# EAGLE design akabeacon_square (EAGLE 7.2.0)
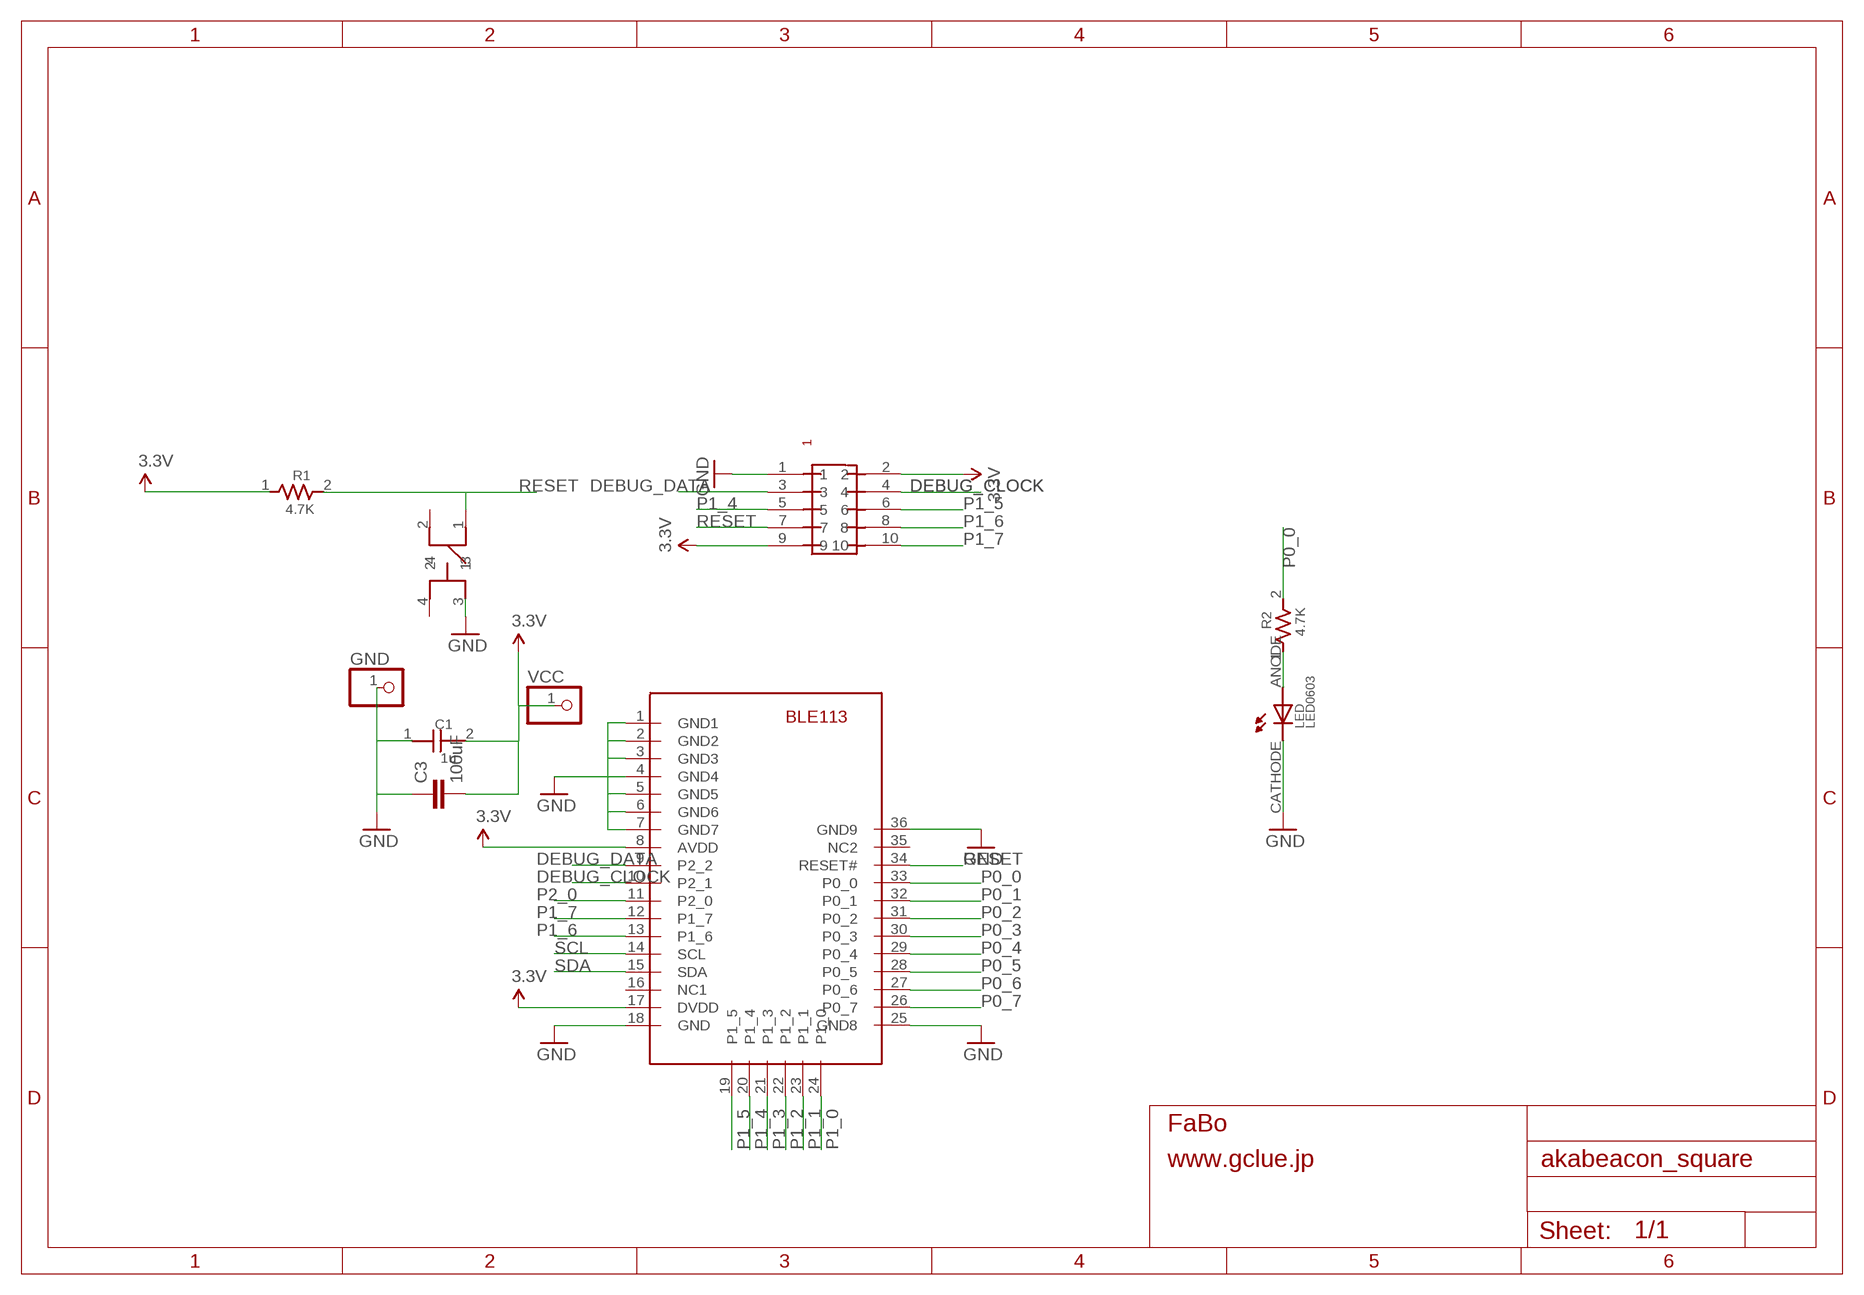
[diagram p0: schematic, sheet 1]

## Parts
C1  1u  CAPACITOR0603  [0603]
C3  100uF  10UF-6.3V-20%(1206)  [1206]
GND  PINHD-1X1CB  [1X01-CLEANBIG]
LED  LED0603  [0603]
R1  4.7K  RESISTOR0603  [0603]
R2  4.7K  RESISTOR0603  [0603]
U$2  PIN-HEADER-SMT(1.27MM)2X5  [PIN-HEADER-SMT(1.27MM)2X5]
U$5  BLE113  [BLE113]
U$8  SWITCH-LS6J2M-T  [SWICTH-LS6J2M-T]
VCC  PINHD-1X1CB  [1X01-CLEANBIG]

## Nets
3.3V: C1.2 C3.2 R1.1 U$2.2 U$2.9 U$5.8(AVDD) U$5.17(DVDD) VCC.1
DEBUG_CLOCK: U$2.4 U$5.10(P2_1)
DEBUG_DATA: U$2.3 U$5.9(P2_2)
GND: C1.1 C3.1 GND.1 LED.CATHODE U$2.1 U$5.1(GND1) U$5.2(GND2) U$5.3(GND3) U$5.4(GND4) U$5.5(GND5) U$5.6(GND6) U$5.7(GND7) U$5.18(GND) U$5.25(GND8) U$5.36(GND9) U$8.3
N$2: LED.ANODE R2.1
P0_0: R2.2 U$5.33(P0_0)
P0_1: U$5.32(P0_1)
P0_2: U$5.31(P0_2)
P0_3: U$5.30(P0_3)
P0_4: U$5.29(P0_4)
P0_5: U$5.28(P0_5)
P0_6: U$5.27(P0_6)
P0_7: U$5.26(P0_7)
P1_0: U$5.24(P1_0)
P1_1: U$5.23(P1_1)
P1_2: U$5.22(P1_2)
P1_3: U$5.21(P1_3)
P1_4: U$2.5 U$5.20(P1_4)
P1_5: U$2.6 U$5.19(P1_5)
P1_6: U$2.8 U$5.13(P1_6)
P1_7: U$2.10 U$5.12(P1_7)
P2_0: U$5.11(P2_0)
RESET: R1.2 U$2.7 U$5.34(RESET#) U$8.1
SCL: U$5.14(SCL)
SDA: U$5.15(SDA)
Unconnected: U$5.16(NC1) U$5.35(NC2) U$8.2 U$8.4

## Library data of the parts
C1 = GClue-Capacitor:CAPACITOR
C3 = SparkFun-Capacitors:10UF-6.3V-20%(1206): CAP-10057 Ceramic; PROD_ID: CAP-10057; VALUE: 10uF
GND VCC = adafruit:PINHD-1X1: Pin header 1x1 for 0.1" spacing With round pins
LED = GClue-LED:LED
R1 R2 = GClue-Resistors:RESISTOR
U$2 = gclue:PIN-HEADER-SMT(1.27MM)2X5: PIN-HEADER-SMT (1.27MM) 2x5
U$5 = gclue:BLE113
U$8 = gclue:SWITCH-LS6J2M-T

## Board
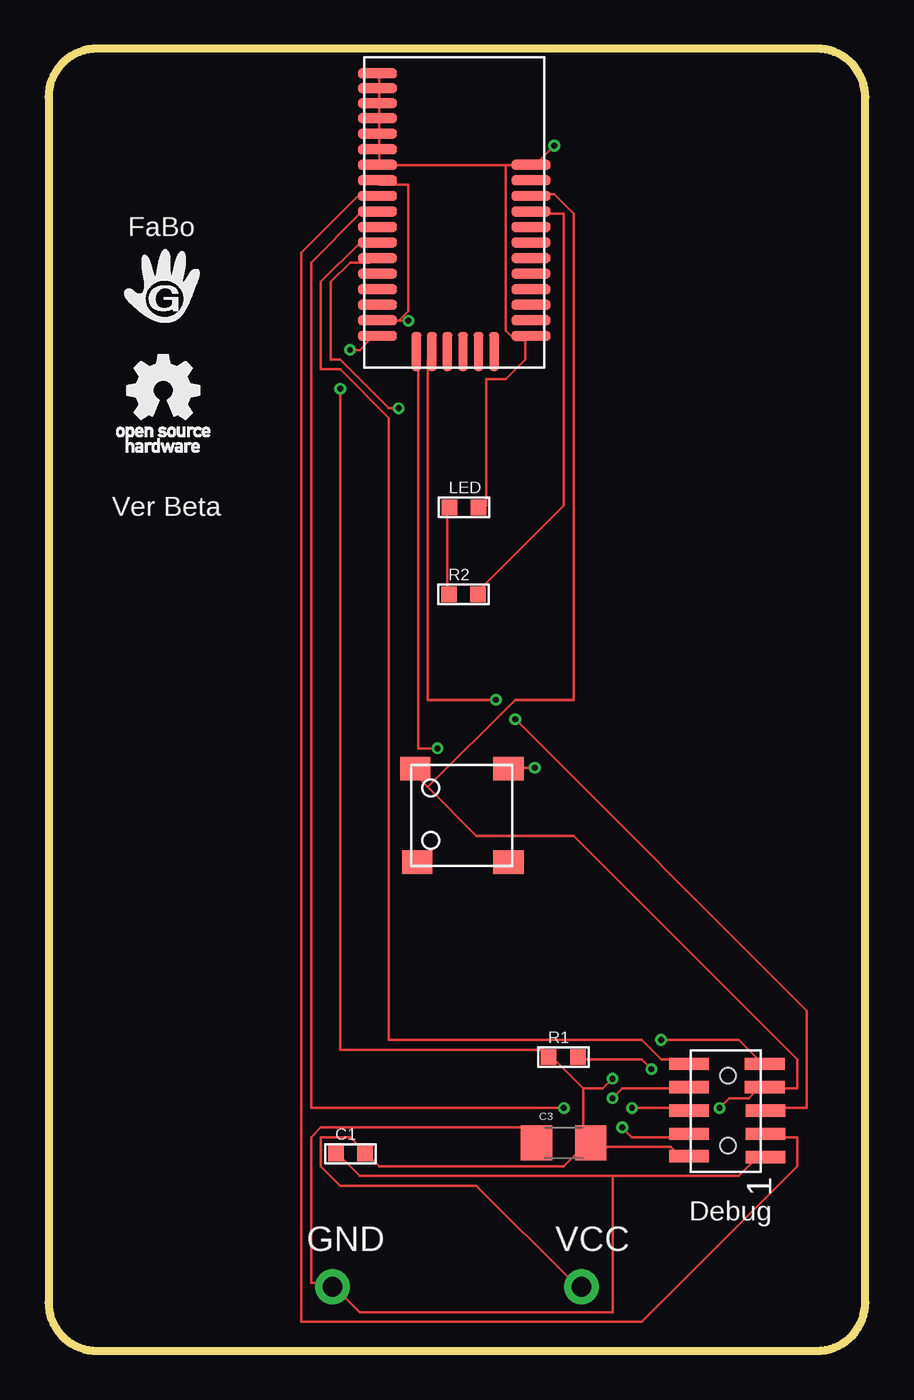
[diagram p1: board, top side]
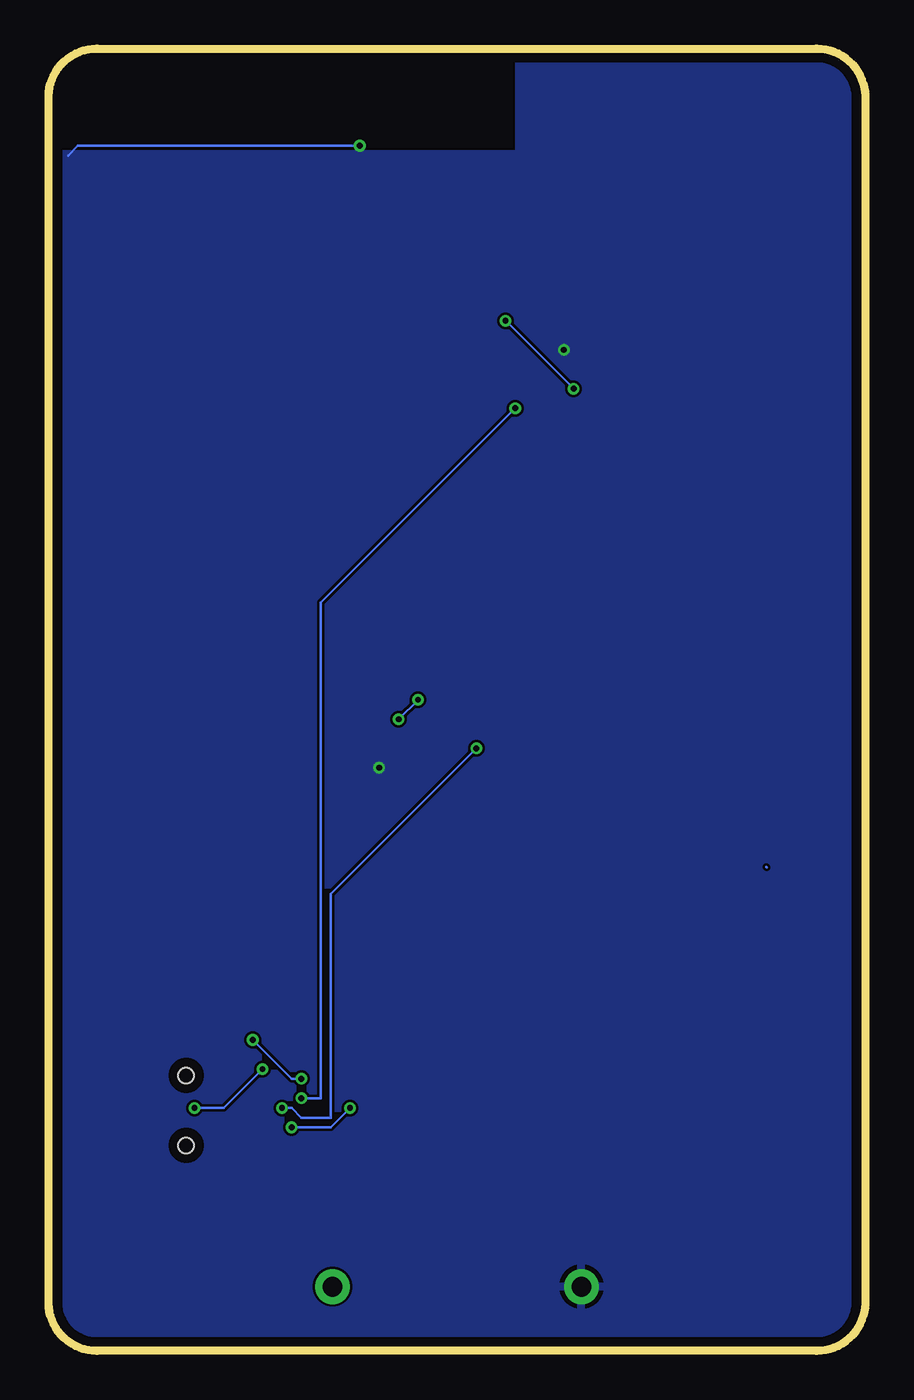
[diagram p2: board, bottom side, seen from below]

Size 42 x 67 mm. Coordinates in mm from the lower left corner, seen from the top.
Outline: 0,64.5 0,2.5 arc90 2.5,0 39.5,0 arc90 42,2.5 42,64.5 arc90 39.5,67 2.5,67 arc90 0,64.5
Copper layers (1+2*15+16): Top 0.018mm / dielectric 0.25mm / Route2 0.035mm / dielectric 1mm / Route15 0.035mm / dielectric 0.25mm / Bottom 0.018mm
Design rules "pban_5mil-l4": minimum track width 5mil, minimum drill 0.3mm, track to track 5mil, track to pad 0.229mm, pad to pad 5mil, via to via 5mil, smd to smd 5mil, copper to edge 0.5mm, drill to drill 0.5mm, minimum pad ring 0.15mm, minimum via ring 0.15mm, stop-mask expansion 4mil, vias tented up to drill 0.35mm, thermal gap 10mil

### Footprints (pad centres in the part's own frame; a part is rotated, then mirrored left to right if it is on the bottom)
0603 = smd 0.8 x 0.8: 1 -0.75,0; 2 0.75,0
1206 = smd 1.6 x 1.8: 1 -1.4,0; 2 1.4,0
1X01-CLEANBIG = drill 1.016 pad 1.778: 1 0,0
0603' = smd 0.8 x 0.8: ANODE -0.75,0; CATHODE 0.75,0
PIN-HEADER-SMT(1.27MM)2X5 = smd 0.635 x 2.032: 1 -2.4,-1.95; 2 -2.35,2; 3 -1.2,-1.95; 4 -1.2,2; 5 0,-1.95; 6 0,2; 7 1.2,-1.9; 8 1.2,2; 9 2.4,-1.9; 10 2.4,2 | hole 0.8: 1.8,0; -1.8,0
BLE113 = smd 2 x 0.5: 1 -5.08,5.08; 2 -5.08,4.31; 3 -5.08,3.54; 4 -5.08,2.77; 5 -5.08,1.97; 6 -5.08,1.17; 7 -5.08,0.37; 8 -5.08,-0.43; 9 -5.08,-1.23; 10 -5.08,-2.03; 11 -5.08,-2.83; 12 -5.08,-3.63; 13 -5.08,-4.43; 14 -5.08,-5.23; 15 -5.08,-6.03; 16 -5.08,-6.83; 17 -5.08,-7.63; 18 -5.08,-8.43; 25 2.82,-8.43; 26 2.82,-7.63; 27 2.82,-6.83; 28 2.82,-6.03; 29 2.82,-5.23; 30 2.82,-4.43; 31 2.82,-3.63; 32 2.82,-2.83; 33 2.82,-2.03; 34 2.82,-1.23; 35 2.82,-0.43; 36 2.82,0.37 | smd 0.5 x 2: 19 -3.08,-9.23; 20 -2.28,-9.23; 21 -1.48,-9.23; 22 -0.68,-9.23; 23 0.12,-9.23; 24 0.92,-9.23
SWICTH-LS6J2M-T = smd 1.55 x 1.2: 1 -2.4,2.4; 2 -2.3,-2.4; 3 2.4,2.4; 4 2.4,-2.4

### Placement (x,y rotation side)
C1  15.52,10.14 0 top
C3  26.49,10.71 0 top
GND  14.6,3.3 0 top
LED  LED0603  [0603']  21.36,43.41 0 top
R1  26.47,15.12 0 top
R2  21.34,38.93 0 top
U$2  34.93,12.37 90 top
U$3  [LOGO_FABO_M]  5.8,54.8 0 top
U$4  [LOGO_OSHW_T_M]  5.9,49.4 0 top
U$5  21.99,60.65 0 top
U$8  21.25,27.55 0 top
VCC  27.4,3.3 0 top

### Tracks (layer width: path | path; a pad name or v marks a point on that pad's centre or on a via)
3.3V  (via drill 0.3)
  Top 0.127: 18,53 17,53 U$5.17 | 18,53 18.5,53.5 18.5,60 17,60 U$5.8 | C3.2 27.5,10.5 26.5,9.5 17,9.5 16.5,10 C1.2 16,10.5 15.5,11 14,11 14,9.5 15,8.5 22,8.5 27,3.5 VCC.1 | 27.5,13.5 26,15 R1.1 25.5,15.5 15,15.5 v15,49.5 | 27.5,13.5 27.5,11 C3.2 | U$2.2 32.5,10 32,10.5 28,10.5 C3.2 | v31.5,16 35.5,16 36.5,15 U$2.9 | v29,14 28.5,13.5 27.5,13.5 | v18.5,53 18,53
  Bottom 0.127: v31.5,16 29.5,14 v29,14 | v15,49.5 v18.5,53
AGND
  Bottom 0.127: 5.1,24.9 5.06,24.88
DEBUG_CLOCK  (via drill 0.3)
  Top 0.127: v26.5,12.5 13.5,12.5 13.5,56 16,58.5 16.5,58.5 U$5.10 | v29.5,11.5 30,11 32.5,11 U$2.4
  Bottom 0.127: v26.5,12.5 27.5,11.5 v29.5,11.5
DEBUG_DATA
  Top 0.127: U$5.9 16.5,59.5 16,59.5 13,56.5 13,1.5 30.5,1.5 38.5,9.5 38.5,11 37,11 U$2.3
GND  (via drill 0.3)
  Top 0.127: 29,9 35.5,9 36.5,10 U$2.1 | 29,9 16,9 15,10 C1.1 | 24.5,52 24.5,51 23.5,50 22.5,50 22.5,43.5 LED.CATHODE | 17,65 17,65.5 U$5.1 | 17,64 17,63.5 | 17,62 17,61 | 17,62 17,62.5 | 17,62 U$5.6 | 17,62.5 17,63.5 | 17,63.5 U$5.4 | 17,62.5 U$5.5 | 17,64 17,65 | 17,65 U$5.2 | 17,64 U$5.3 | v25,30 24,30 U$8.3 | v26,62 25,61 U$5.36 24.5,61 23.5,61 | C3.1 25,11 24.5,11.5 14,11.5 13.5,11 13.5,3.5 14.5,3.5 GND.1 15,3 16,2 29,2 29,9 | v15.5,51.5 16,51.5 16.5,52 U$5.18 | 23.5,61 17,61 | 17,61 U$5.7 | 24.5,52 24,52 23.5,52.5 23.5,61 | 24.5,52 U$5.25
  Bottom 0.127: 41,61.5 40.5,62 v26,62
  pour Bottom: -0.6,-1.1 42.8,-1.1 42.9,61.6 17.8,61.6 17.8,67.6 -0.7,67.6 -0.7,4.4
N$2
  Top 0.127: R2.1 20.5,39 20.5,43.5 LED.ANODE
P0_0
  Top 0.127: R2.2 22,39 26.5,43.5 26.5,58.5 25,58.5 U$5.33
P1_4  (via drill 0.3)
  Top 0.127: v23,33.5 19.5,33.5 19.5,51 U$5.20 | v24,32.5 39,17.5 39,12.5 37,12.5 U$2.5
  Bottom 0.127: v24,32.5 v23,33.5
P1_5  (via drill 0.3)
  Top 0.127: v20,31 19,31 19,51 U$5.19 | v30,12.5 32.5,12.5 U$2.6
  Bottom 0.127: v20,31 27.5,23.5 27.5,12 29,12 29.5,12.5 v30,12.5
P1_6  (via drill 0.3)
  Top 0.127: v18,48.5 17.5,48.5 15,51 14.5,51 14.5,55 15.5,56 16.5,56 U$5.13 | v29,13 29.5,13.5 32.5,13.5 U$2.8
  Bottom 0.127: v18,48.5 28,38.5 28,13 v29,13
P1_7
  Top 0.127: U$5.12 16.5,57 16,57 14,55 14,50.5 15,50.5 17.5,48 17.5,16 30.5,16 31.5,15 32.5,15 U$2.10
RESET  (via drill 0.3)
  Top 0.127: v31,14.5 30.5,15 27.5,15 R1.2 | v34.5,12.5 35,13 36,13 36.5,13.5 U$2.7 37,13.5 38.5,13.5 38.5,15 27,26.5 22,26.5 19.5,29 | 19.5,29 19,29.5 U$8.1 | 19.5,29 24,33.5 27,33.5 27,58.5 26,59.5 25,59.5 U$5.34
  Bottom 0.127: v31,14.5 33,12.5 v34.5,12.5

### Text on the board
tPlace: Ver Beta | Debug